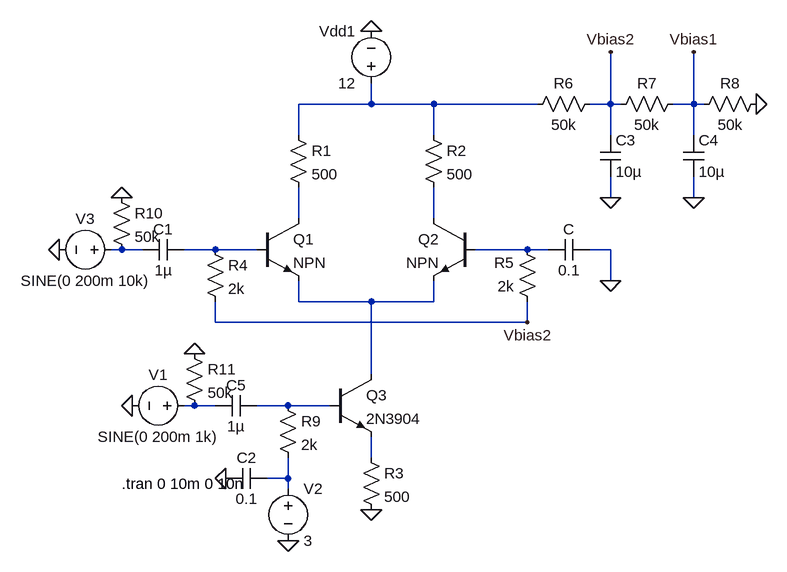
[diagram p0: schematic AnalogEx7_2.asc]
AnalogEx7_2.asc, the LTspice schematic file:
Version 4
SHEET 1 980 680
WIRE -16 -288 -16 -320
WIRE -16 -288 -128 -288
WIRE 80 -288 -16 -288
WIRE 240 -288 80 -288
WIRE 352 -288 352 -368
WIRE 352 -288 320 -288
WIRE 368 -288 352 -288
WIRE 480 -288 480 -368
WIRE 480 -288 448 -288
WIRE 496 -288 480 -288
WIRE -128 -240 -128 -288
WIRE 80 -240 80 -288
WIRE 352 -240 352 -288
WIRE 480 -240 480 -288
WIRE 352 -144 352 -176
WIRE 480 -144 480 -176
WIRE -128 -112 -128 -160
WIRE 80 -112 80 -160
WIRE -400 -64 -416 -64
WIRE -368 -64 -400 -64
WIRE -256 -64 -304 -64
WIRE -192 -64 -256 -64
WIRE 224 -64 144 -64
WIRE 256 -64 224 -64
WIRE 352 -64 320 -64
WIRE 352 -16 352 -64
WIRE -128 16 -128 -16
WIRE -16 16 -128 16
WIRE 80 16 80 -16
WIRE 80 16 -16 16
WIRE -256 48 -256 16
WIRE 224 48 224 16
WIRE 224 48 -256 48
WIRE -16 128 -16 16
WIRE -288 176 -304 176
WIRE -256 176 -288 176
WIRE -144 176 -192 176
WIRE -80 176 -144 176
WIRE -16 256 -16 224
WIRE -144 288 -144 256
WIRE -144 288 -176 288
WIRE -144 304 -144 288
FLAG 352 -16 0
FLAG -16 336 0
FLAG -496 -64 0
FLAG -16 -400 0
FLAG 576 -288 0
FLAG 352 -144 0
FLAG 480 -144 0
FLAG 352 -368 Vbias2
FLAG 480 -368 Vbias1
FLAG 224 48 Vbias2
FLAG -384 176 0
FLAG -288 96 0
FLAG -400 -144 0
FLAG -144 384 0
FLAG -240 288 0
SYMBOL res -144 -256 R0
SYMATTR InstName R1
SYMATTR Value 500
SYMBOL res 64 -256 R0
SYMATTR InstName R2
SYMATTR Value 500
SYMBOL cap -304 -80 R90
WINDOW 0 0 32 VBottom 2
WINDOW 3 32 32 VTop 2
SYMATTR InstName C1
SYMATTR Value 1µ
SYMBOL cap 320 -80 R90
WINDOW 0 0 32 VBottom 2
WINDOW 3 32 32 VTop 2
SYMATTR InstName C
SYMATTR Value 0.1
SYMBOL res -272 -80 R0
SYMATTR InstName R4
SYMATTR Value 2k
SYMBOL npn -80 128 R0
SYMATTR InstName Q3
SYMATTR Value 2N3904
SYMBOL res -32 240 R0
SYMATTR InstName R3
SYMATTR Value 500
SYMBOL voltage -400 -64 R90
WINDOW 0 -32 56 VBottom 2
WINDOW 3 32 56 VTop 2
WINDOW 123 0 0 Left 0
WINDOW 39 0 0 Left 0
SYMATTR InstName V3
SYMATTR Value SINE(0 200m 10k)
SYMBOL voltage -16 -304 R180
WINDOW 0 24 96 Left 2
WINDOW 3 24 16 Left 2
WINDOW 123 0 0 Left 0
WINDOW 39 0 0 Left 0
SYMATTR InstName Vdd1
SYMATTR Value 12
SYMBOL res 336 -304 R90
WINDOW 0 0 56 VBottom 2
WINDOW 3 32 56 VTop 2
SYMATTR InstName R6
SYMATTR Value 50k
SYMBOL res 464 -304 R90
WINDOW 0 0 56 VBottom 2
WINDOW 3 32 56 VTop 2
SYMATTR InstName R7
SYMATTR Value 50k
SYMBOL res 592 -304 R90
WINDOW 0 0 56 VBottom 2
WINDOW 3 32 56 VTop 2
SYMATTR InstName R8
SYMATTR Value 50k
SYMBOL cap 336 -240 R0
SYMATTR InstName C3
SYMATTR Value 10µ
SYMBOL cap 464 -240 R0
SYMATTR InstName C4
SYMATTR Value 10µ
SYMBOL res 240 32 R180
WINDOW 0 36 76 Left 2
WINDOW 3 36 40 Left 2
SYMATTR InstName R5
SYMATTR Value 2k
SYMBOL cap -192 160 R90
WINDOW 0 0 32 VBottom 2
WINDOW 3 32 32 VTop 2
SYMATTR InstName C5
SYMATTR Value 1µ
SYMBOL res -160 160 R0
SYMATTR InstName R9
SYMATTR Value 2k
SYMBOL voltage -288 176 R90
WINDOW 0 -32 56 VBottom 2
WINDOW 3 32 56 VTop 2
WINDOW 123 0 0 Left 0
WINDOW 39 0 0 Left 0
SYMATTR InstName V1
SYMATTR Value SINE(0 200m 1k)
SYMBOL npn -192 -112 R0
SYMATTR InstName Q1
SYMBOL npn 144 -112 M0
SYMATTR InstName Q2
SYMBOL res -416 -160 R0
SYMATTR InstName R10
SYMATTR Value 50k
SYMBOL res -304 80 R0
SYMATTR InstName R11
SYMATTR Value 50k
SYMBOL voltage -144 288 R0
WINDOW 123 0 0 Left 0
WINDOW 39 0 0 Left 0
SYMATTR InstName V2
SYMATTR Value 3
SYMBOL cap -240 272 M90
WINDOW 0 0 32 VBottom 2
WINDOW 3 32 32 VTop 2
SYMATTR InstName C2
SYMATTR Value 0.1
TEXT -400 296 Left 2 !.tran 0 10m 0 10n

The netlist it stands for:
* AnalogEx7_2.asc
R1 N001 N002 500
R2 N001 N003 500
C1 N005 N004 1µ
C 0 N006 0.1
R4 N005 Vbias2 2k
Q3 N007 N009 N010 0 2N3904
R3 N010 0 500
V3 N004 0 SINE(0 200m 10k)
Vdd1 N001 0 12
R6 Vbias2 N001 50k
R7 Vbias1 Vbias2 50k
R8 0 Vbias1 50k
C3 Vbias2 0 10µ
C4 Vbias1 0 10µ
R5 Vbias2 N006 2k
C5 N009 N008 1µ
R9 N009 N011 2k
V1 N008 0 SINE(0 200m 1k)
Q1 N002 N005 N007 0 NPN
Q2 N003 N006 N007 0 NPN
R10 0 N004 50k
R11 0 N008 50k
V2 N011 0 3
C2 0 N011 0.1
.model NPN NPN
.model PNP PNP
.lib standard.bjt
.tran 0 10m 0 10n
.backanno
.end